# EAGLE design orient-beetle (EAGLE 9.6.2)
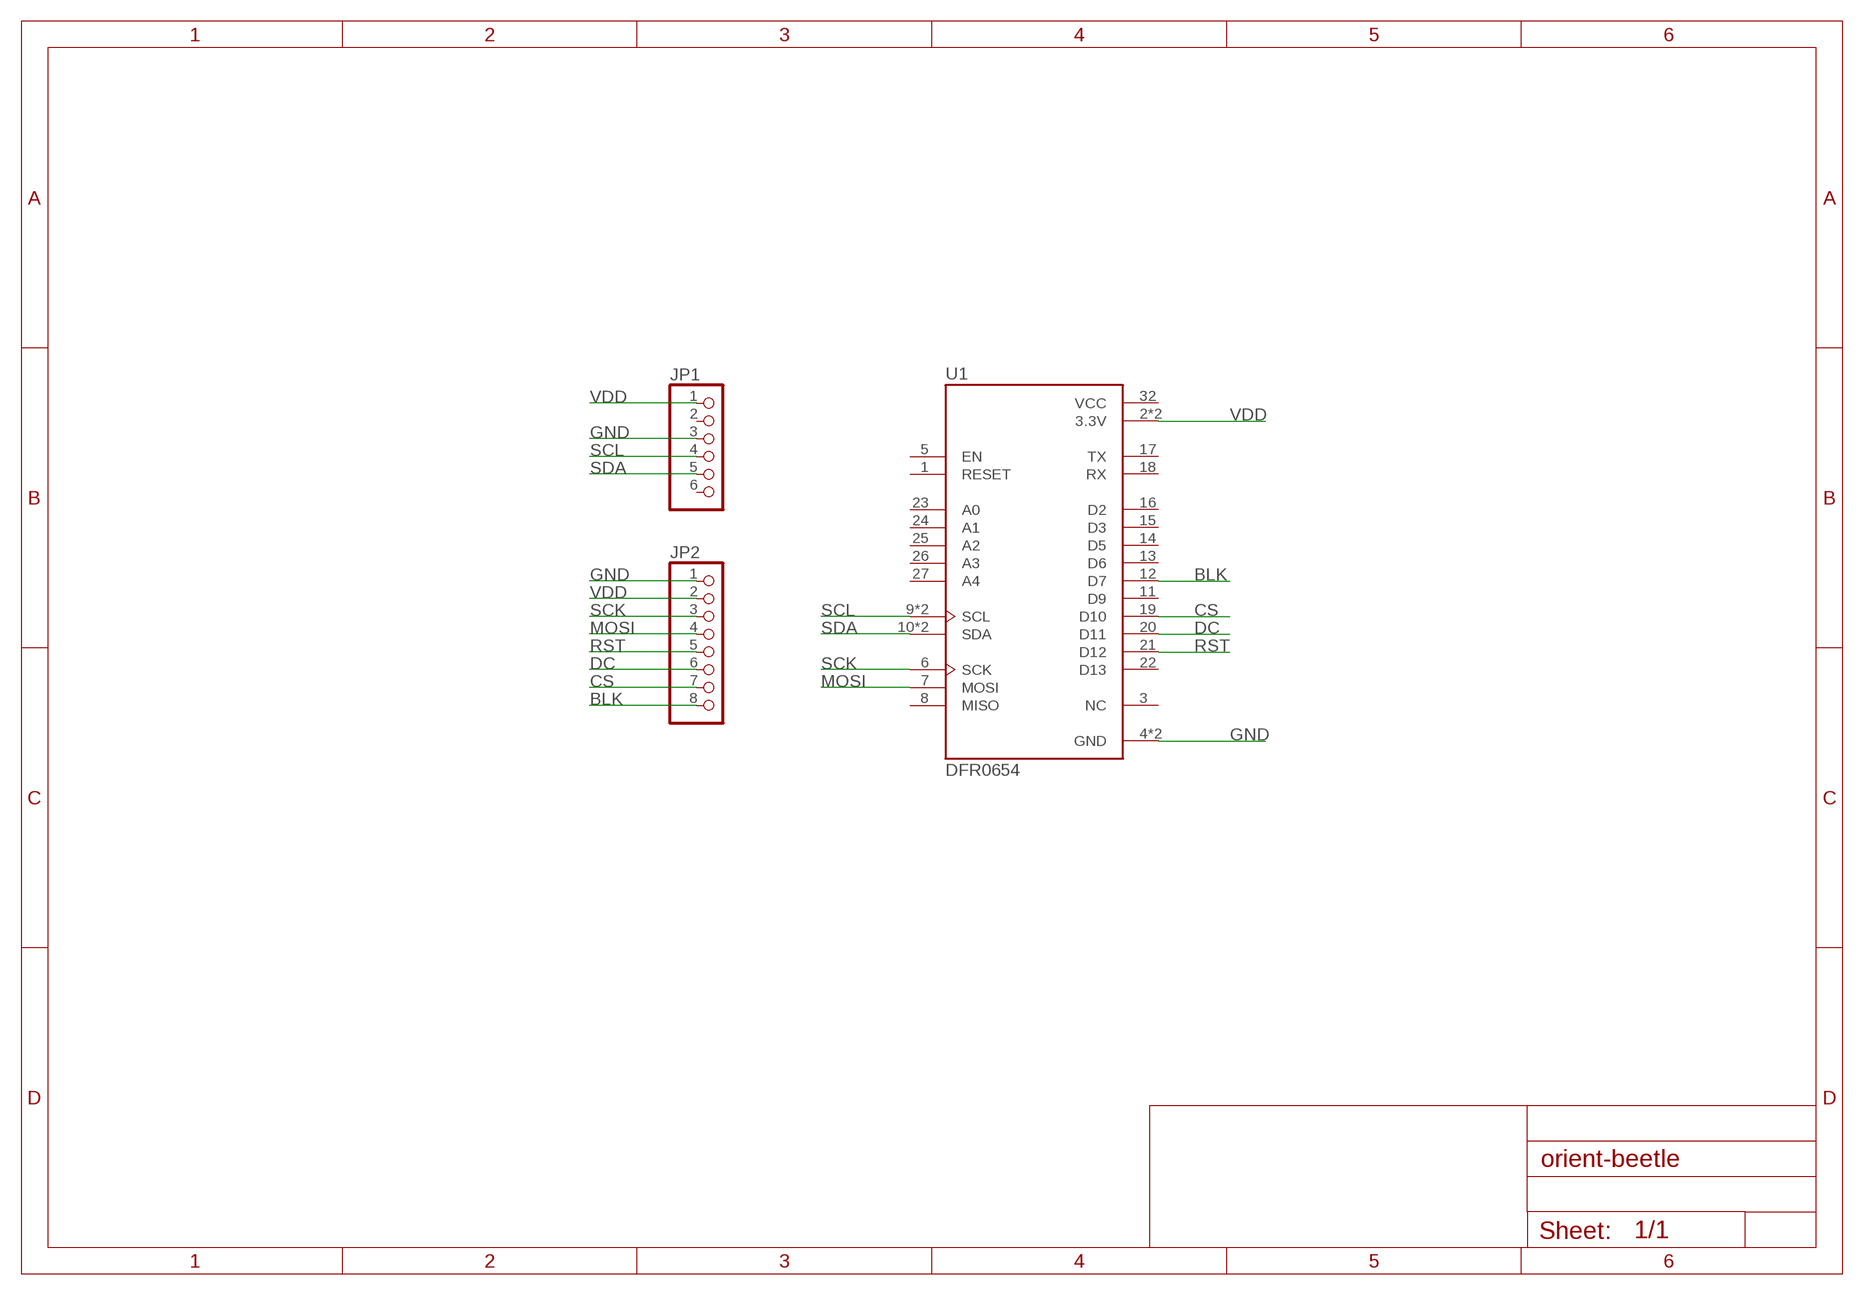
[diagram p0: schematic, sheet 1]

## Parts
JP1  PINHD-1X6  [1X06]
JP2  PINHD-1X8  [1X08]
U1  DFR0654  [MODULE_DFR0654]

## Nets
BLK: JP2.8 U1.12(D7)
CS: JP2.7 U1.19(D10)
DC: JP2.6 U1.20(D11)
GND: JP1.3 JP2.1 U1.4(GND) U1.30(GND)
MOSI: JP2.4 U1.7(MOSI)
RST: JP2.5 U1.21(D12)
SCK: JP2.3 U1.6(SCK)
SCL: JP1.4 U1.9(SCL) U1.29(SCL)
SDA: JP1.5 U1.10(SDA) U1.28(SDA)
VDD: JP1.1 JP2.2 U1.2(3.3V) U1.31(3.3V)
Unconnected: JP1.2 JP1.6 U1.1(RESET) U1.3(NC) U1.5(EN) U1.8(MISO) U1.11(D9) U1.13(D6) U1.14(D5) U1.15(D3) U1.16(D2) U1.17(TX) U1.18(RX) U1.22(D13) U1.23(A0) U1.24(A1) U1.25(A2) U1.26(A3) U1.27(A4)

## Power pins joined to a net without a drawn wire
VCC: U1.32(VCC)

## Library data of the parts
JP1 = pinhead:PINHD-1X6: PIN HEADER
JP2 = pinhead:PINHD-1X8: PIN HEADER
U1 = DFR0654:DFR0654: ESP32-E series Transceiver; 802.11 b/g/n/d/e/i/k/r (Wi-Fi, WiFi, WLAN), Bluetooth Smart 4.x Low Energy (BLE) Evaluation Board Check availability <https://pricing.snapeda.com/parts/DFR0654/DFRobot/view-part?ref=eda>; AVAILABILITY: In Stock; DESCRIPTION: ESP32-E series Transceiver; 802.11 b/g/n/d/e/i/k/r (Wi-Fi, WiFi, WLAN), Bluetooth® Smart 4.x Low Energy (BLE) Evaluation Board; MF: DFRobot; MP: DFR0654; PACKAGE: None; PRICE: None; PURCHASE-URL: https://pricing.snapeda.com/search/part/DFR0654/?ref=eda

## Board
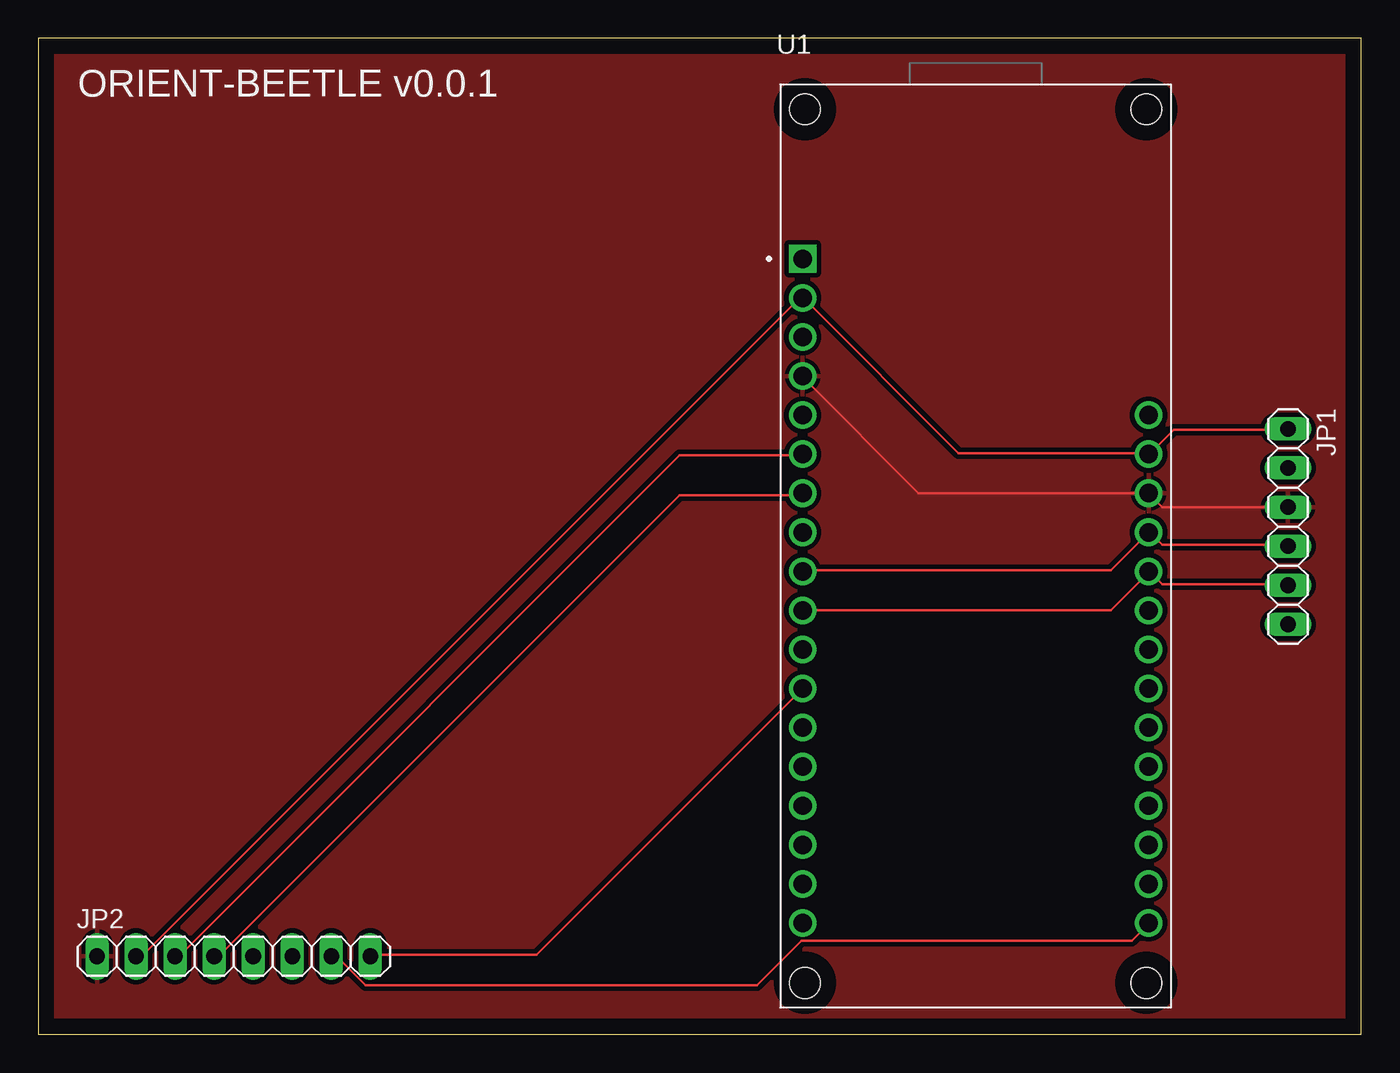
[diagram p1: board, top side]
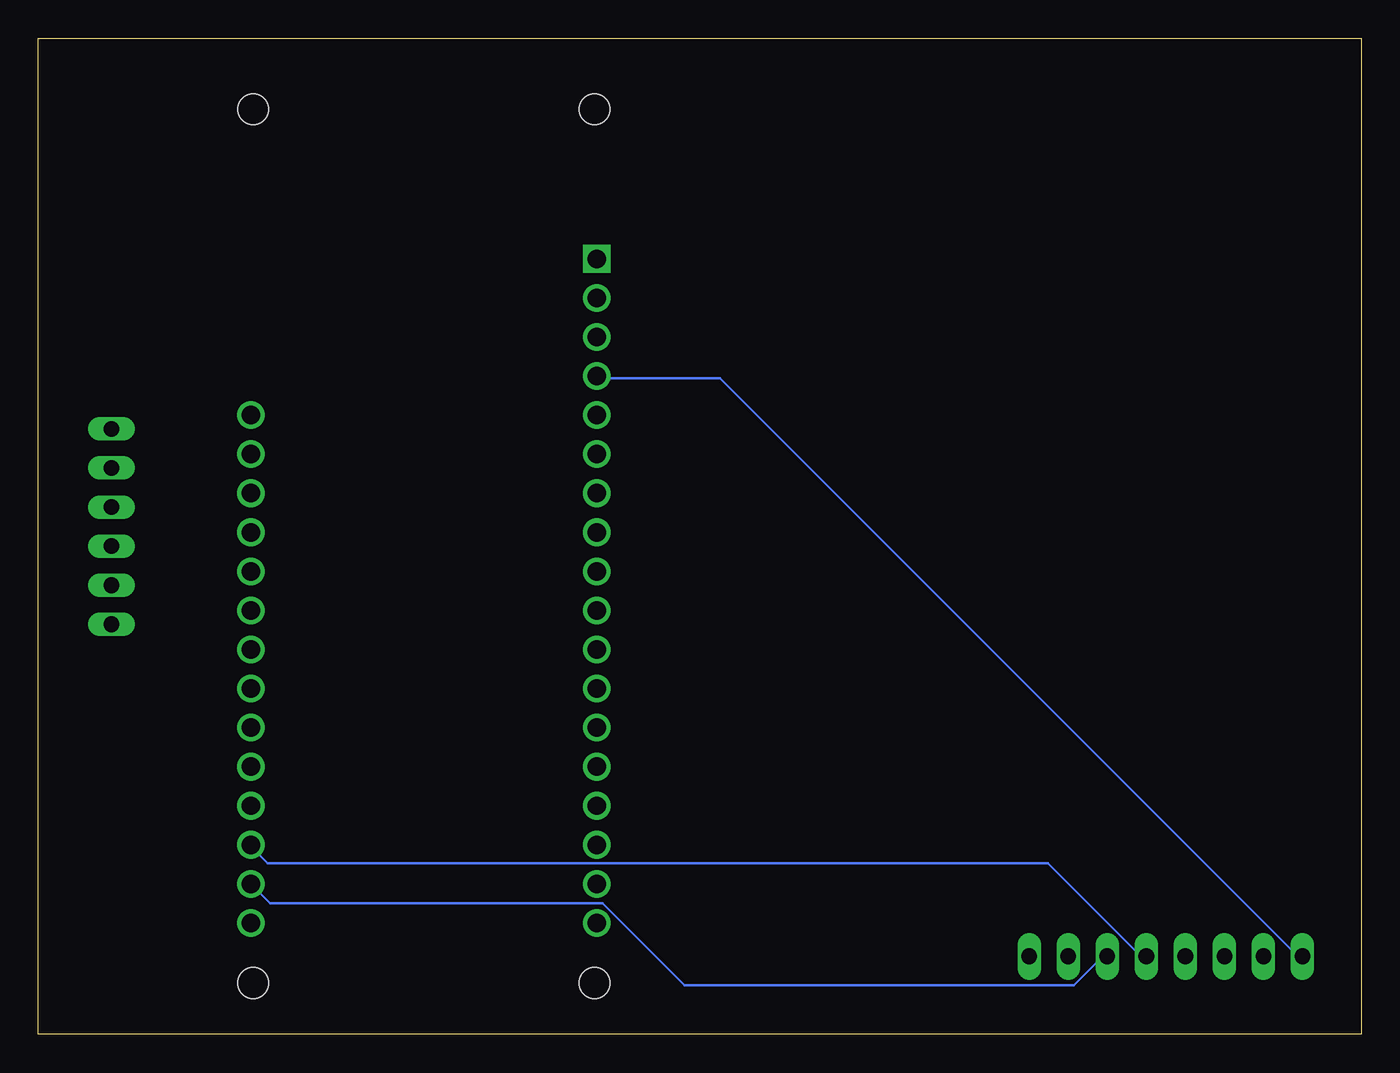
[diagram p2: board, bottom side, seen from below]

Size 86.03 x 64.76 mm. Coordinates in mm from the lower left corner, seen from the top.
Outline: 0,0 86.03,0 86.03,64.76 0,64.76 0,0
Copper layers (1*16): Top 0.035mm / dielectric 1.5mm / Bottom 0.035mm
Design rules "default": minimum track width 6mil, minimum drill 0.35mm, track to track 6mil, track to pad 6mil, pad to pad 6mil, via to via 6mil, smd to smd 6mil, copper to edge 40mil, drill to drill 6mil, minimum pad ring 10mil, minimum via ring 8mil, stop-mask expansion 4mil, vias tented up to drill 0mil, thermal gap 10mil

### Footprints (pad centres in the part's own frame; a part is rotated, then mirrored left to right if it is on the bottom)
1X06 = drill 1.016 long: 1 -6.35,0; 2 -3.81,0; 3 -1.27,0; 4 1.27,0; 5 3.81,0; 6 6.35,0
1X08 = drill 1.016 long: 1 -8.89,0; 2 -6.35,0; 3 -3.81,0; 4 -1.27,0; 5 1.27,0; 6 3.81,0; 7 6.35,0; 8 8.89,0
MODULE_DFR0654 = drill 1.2 square: 1 -11.25,18.68 | drill 1.2: 2 -11.25,16.14; 3 -11.25,13.6; 4 -11.25,11.06; 5 -11.25,8.52; 6 -11.25,5.98; 7 -11.25,3.44; 8 -11.25,0.9; 9 -11.25,-1.64; 10 -11.25,-4.18; 11 -11.25,-6.72; 12 -11.25,-9.26; 13 -11.25,-11.8; 14 -11.25,-14.34; 15 -11.25,-16.88; 16 -11.25,-19.42; 17 -11.25,-21.96; 18 -11.25,-24.5; 19 11.25,-24.5; 20 11.25,-21.96; 21 11.25,-19.42; 22 11.25,-16.88; 23 11.25,-14.34; 24 11.25,-11.8; 25 11.25,-9.26; 26 11.25,-6.72; 27 11.25,-4.18; 28 11.25,-1.64; 29 11.25,0.9; 30 11.25,3.44; 31 11.25,5.98; 32 11.25,8.52 | hole 2: 11.1,28.4; 11.1,-28.4; -11.1,28.4; -11.1,-28.4

### Placement (x,y rotation side)
JP1  81.28,33.02 270 top
JP2  12.7,5.08 0 top
U1  60.96,31.75 0 top

### Tracks (layer width: path | path; a pad name or v marks a point on that pad's centre or on a via)
BLK
  Top 0.152: JP2.8 21.59,5.18 32.41,5.18 49.63,22.4 U1.12
CS
  Top 0.152: JP2.7 19.15,5.03 19.46,5.03 21.29,3.2 46.74,3.2 49.63,6.1 71.12,6.1 72.19,7.16 U1.19
DC
  Bottom 0.152: JP2.6 16.56,5.03 16.87,5.03 18.69,3.2 43.99,3.2 49.33,8.53 70.97,8.53 72.19,9.75 U1.20
GND
  Top 0.152: JP1.3 73.1,34.29 72.34,35.05 U1.30 72.19,35.2 57.25,35.2 49.78,42.67 U1.4
  Bottom 0.152: JP2.1 3.91,5.18 4.22,5.18 41.71,42.67 49.63,42.67 U1.4
  pour Top (isolate 0.305): 0,64.77 86.36,64.77 86.36,0 0,0
MOSI
  Top 0.152: JP2.4 11.53,5.18 11.84,5.18 41.71,35.05 49.63,35.05 U1.7
RST
  Bottom 0.152: JP2.5 13.97,5.18 14.43,5.18 20.37,11.12 71.12,11.12 72.19,12.19 U1.21
SCK
  Top 0.152: JP2.3 8.94,5.18 9.25,5.18 41.71,37.64 49.63,37.64 U1.6
SCL
  Top 0.152: JP1.4 81.18,31.85 73.1,31.85 72.34,32.61 U1.29 72.19,32.61 69.75,30.18 49.78,30.18 U1.9
SDA
  Top 0.152: JP1.5 81.18,29.26 73.1,29.26 72.34,30.02 U1.28 72.19,30.02 69.75,27.58 49.78,27.58 U1.10
VDD
  Top 0.152: JP1.1 81.18,39.32 73.86,39.32 72.34,37.8 U1.31 72.19,37.8 59.84,37.8 49.78,47.85 U1.2 49.63,48.01 6.81,5.18 6.35,5.18 JP2.2

### Text on the board
tPlace: ORIENT-BEETLE v0.0.1